# EAGLE design Adafruit INA3221 Breakout (EAGLE 9.6.2)
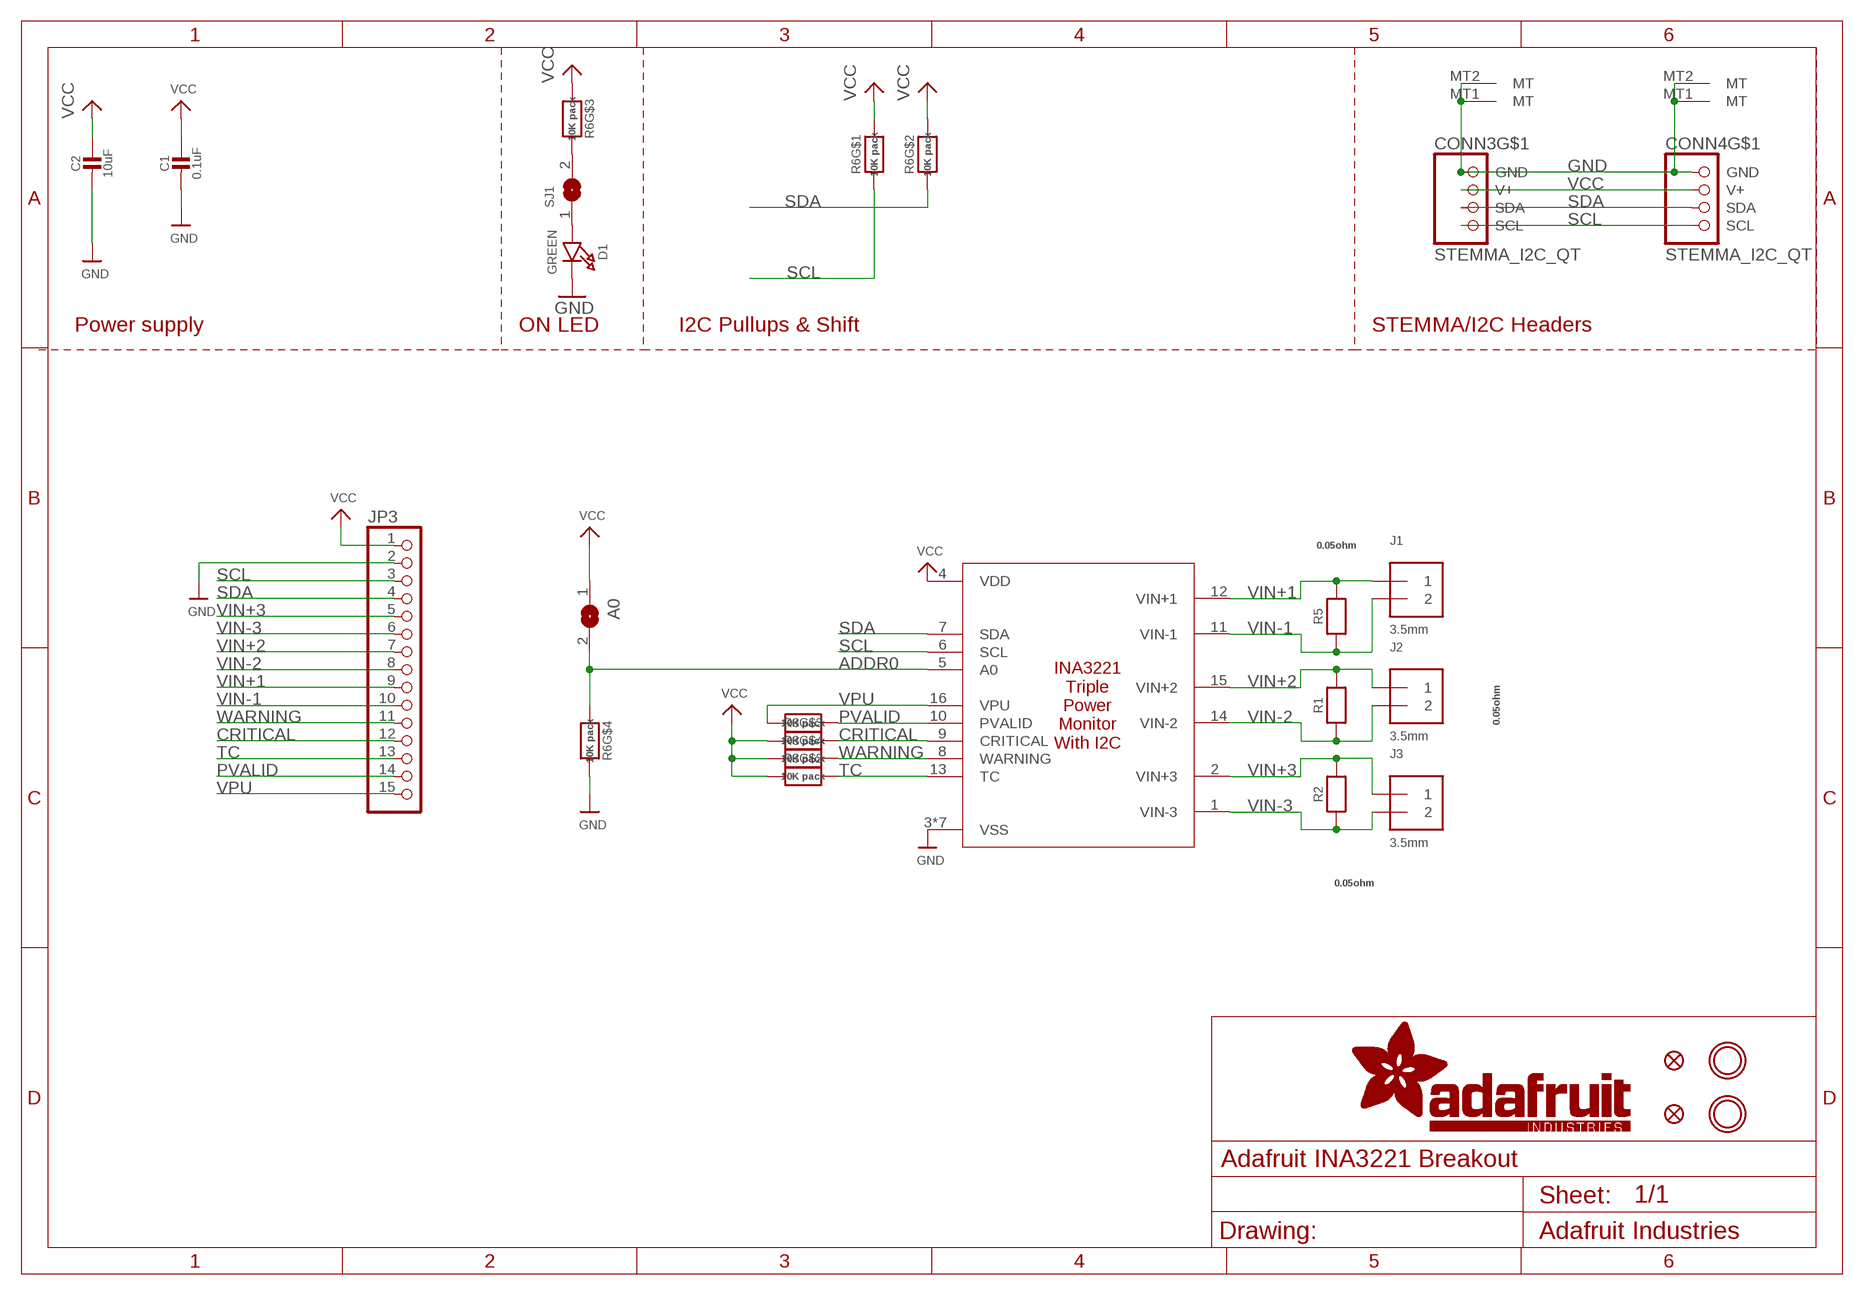
[diagram p0: schematic, sheet 1]

## Parts
A0  SOLDERJUMPERREFLOW_NOPASTE  [SOLDERJUMPER_REFLOW_NOPASTE]
C1  0.1uF  CAP_CERAMIC0603_NO  [0603-NO]
C2  10uF  CAP_CERAMIC0805-NOOUTLINE  [0805-NO]
CONN3  STEMMA_I2C_QT  [JST_SH4]
CONN4  STEMMA_I2C_QT  [JST_SH4]
D1  GREEN  LED0603_NOOUTLINE  [CHIPLED_0603_NOOUTLINE]
FID3  FIDUCIAL_1MM  [FIDUCIAL_1MM]
FID4  FIDUCIAL_1MM  [FIDUCIAL_1MM]
IC1  INA3221  [PVQFN-16]
J1  3.5mm  TERMBLOCK_1X2_3.5MM  [TERMBLOCK_1X2-3.5MM]
J2  3.5mm  TERMBLOCK_1X2_3.5MM  [TERMBLOCK_1X2-3.5MM]
J3  3.5mm  TERMBLOCK_1X2_3.5MM  [TERMBLOCK_1X2-3.5MM]
JP3  HEADER-1X15  [1X15_ROUND_70]
R1  0.05ohm  RESISTOR_1206  [_1206]
R2  0.05ohm  RESISTOR_1206  [_1206]
R3  10K pack  RESISTOR_4PACK  [RESPACK_4X0603]
R5  0.05ohm  RESISTOR_1206  [_1206]
R6  10K pack  RESISTOR_4PACK  [RESPACK_4X0603]
SJ1  SOLDERJUMPERCLOSED  [SOLDERJUMPER_CLOSEDWIRE]
U$20  MOUNTINGHOLE2.5  [MOUNTINGHOLE_2.5_PLATED]
U$21  MOUNTINGHOLE2.5  [MOUNTINGHOLE_2.5_PLATED]

## Nets
ADDR0: A0.2 IC1.5(A0) R6.4
CRITICAL: IC1.9(CRITICAL) JP3.12 R3.6
GND: C1.2 C2.2 CONN3.1(GND) CONN3.MT1(MT) CONN3.MT2(MT) CONN4.1(GND) CONN4.MT1(MT) CONN4.MT2(MT) D1.C IC1.3(VSS) IC1.P$18(VSS) IC1.P$19(VSS) IC1.P$20(VSS) IC1.P$21(VSS) IC1.P$22(VSS) IC1.THERMAL(VSS) JP3.2 R6.5
N$1: R6.6 SJ1.2
N$2: D1.A SJ1.1
PVALID: IC1.10(PVALID) JP3.14 R3.8
SCL: CONN3.4(SCL) CONN4.4(SCL) IC1.6(SCL) JP3.3 R6.1
SDA: CONN3.3(SDA) CONN4.3(SDA) IC1.7(SDA) JP3.4 R6.2
TC: IC1.13(TC) JP3.13 R3.7
VCC: A0.1 C1.1 C2.1 CONN3.2(V+) CONN4.2(V+) IC1.4(VDD) JP3.1 R3.2 R3.3 R3.4 R6.3 R6.7 R6.8
VIN+1: IC1.12(VIN+1) J1.1 JP3.9 R5.2
VIN+2: IC1.15(VIN+2) J2.1 JP3.7 R1.2
VIN+3: IC1.2(VIN+3) J3.1 JP3.5 R2.2
VIN-1: IC1.11(VIN-1) J1.2 JP3.10 R5.1
VIN-2: IC1.14(VIN-2) J2.2 JP3.8 R1.1
VIN-3: IC1.1(VIN-3) J3.2 JP3.6 R2.1
VPU: IC1.16(VPU) JP3.15 R3.1
WARNING: IC1.8(WARNING) JP3.11 R3.5

## Notes on the sheet
- Power supply | ON LED | I2C Pullups & Shift | STEMMA/I2C Headers

## Library data of the parts
A0 SJ1 = microbuilder:SOLDERJUMPER: SMD Solder JUMPER Solder the two pads together to create a connection, or remove the solder to break it. REFLOW - Use this footprint for solder paste and reflow ovens. WAVE - Use this footprint for hand-soldering (larger pads). CLOSED - Has a trace between the two pads to ensure it is closed by default. The trace needs to be cut to disable the jumper, and can be closed again by creating a solder bridge between the two pads.
C1 C2 = microbuilder:CAP_CERAMIC: Ceramic Capacitors For new designs, use the packages preceded by an '_' character since they are more reliable: The following footprints should be used on most boards: _0402 - Standard footprint for regular board layouts _0603 - Standard footprint for regular board layouts _0805 - Standard footprint for regular board layouts _1206 - Standard footprint for regular board layouts For extremely tight-pitch boards where space is at a premium, the following 'micro-pitch' footprints can be used (smaller pads, no silkscreen outline, etc.): _0402MP - Micro-pitch footprint for very dense/compact boards _0603MP - Micro-pitch footprint for very dense/compact boards _0805MP - Micro-pitch footprint for very dense/compact boards _1206MP - Micro-pitch footprint for very dense/compact boards
CONN3 CONN4 = adafruit_electromech:STEMMA_I2C; LCSC: C2845363
D1 = microbuilder:LED: LED 0603 - 0603 Surface Mount Package 2mA: Green LED - Low Power (3.9mcd, 2ma, 1.7Vf) - Digikey: 475-2709-2-ND Orange LED - Low Power (9.8mcd, 2ma, 1.8Vf) - Digikey: 475-1194-2-ND Red LED - Low Power (5mcd, 2ma, 1.8Vf) - Digikey: 475-1195-2-ND Yellow LED - Low Power (7mcd, 2ma, 1.8Vf) - Digikey: 475-1196-2-ND 5mA: Blue LED - Low Power (17mcd, 5ma, 2.9Vf) - Digikey: LNJ937W8CRACT-ND 0805 - 0805 Surface Mount Package 2mA: Red LED (8.8mcd, 2mA, 1.8Vf, Clear) - Low Power [Digikey: 475-2510-1-ND] Green LED (5mcd, 2mA, 1.8Vf, Clear) - Low Power [Digikey: 475-2730-1-ND] Yellow LED (11.3mcd, 2mA, 1.8Vf, Clear) - Low Power [Digikey: 475-2555-1-ND] 20mA: Red LED (104mcd, 20mA, Diffused) - LS R976 [Digikey: 475-1278-6-ND] Red LED (12mcd, 20mA, 2.0Vf, Clear) - APT2012EC [Digikey: 754-1128-1-ND] Green LED (15mcd, 20mA, 2.2Vf, Clear) - APT2012GC [Digikey: 754-1131-1-ND] Orange LED (160mcd, 20mA, 2.1Vf, Clear) - APT2012SECK [Digikey: 754-1130-1-ND] 1206 - 1206 Surface Mount Package Green LED (26mcd, 20mA, Diffused) - LG N971 [Digikey: 475-1407-6-ND] Red LED (15mcd, 20mA, Diffused) - LH N974 [Digikey: 475-1416-6-ND] Cree - Cree High-Power Surface Mount LEDs XPEBWT-L1-0000-00D50 - White 111lm 350mA 2.9Vf 6200K 110° XTEAWT-00-0000-00000LEE3 - White 114lm 350mA 2.85Vf 5000K 115° Everlight - Everlight 45-21 Series Surface Mount LEDs 45-21/QK2C-B2832AC2CB2/2T - Warm White 2000mcd 20mA 3.25Vf 3050K 120° 45-21/LK2C-B38452C4CB2/2T - Nuetral White 2000mcd 20mA 3.25Vf 4150K 120° 45-21/LK2C-B50634C6CB2/2T - Cold White 2200mcd 20mA 3.25Vf 5650K 120° PLCC2 Reverse Mount LS T77K-J1L2-1-0-2-R18-Z - Red 11.25mcd 2mA 1.8Vf 630nm 120° LO T77K-L1M2-24-Z - Orange 19.6mcd 2mA 1.8Vf 606nm 120° LY T77K-K2M1-26-Z - Yellow 15.7mcd 2mA 1.8Vf 587nm 120°; ROT: 270
FID3 FID4 = microbuilder:FIDUCIAL: Fiducial Alignment Points Various fiducial points for machine vision alignment.; BOM: EXCLUDE
IC1 = adafruit_power:INA3221
J1-J3 = adafruit_electromech:TERMBLOCK_1X2: 3.5mm Terminal block http://www.ladyada.net/library/pcb/eaglelibrary.html; ROT: 180
JP3 = microbuilder:HEADER-1X15: 1x15 Header
R1 R2 R5 = microbuilder:RESISTOR: Resistors For new designs, use the packages preceded by an '_' character since they are more reliable: The following footprints should be used on most boards: _0402 - Standard footprint for regular board layouts _0603 - Standard footprint for regular board layouts _0805 - Standard footprint for regular board layouts _1206 - Standard footprint for regular board layouts For extremely tight-pitch boards where space is at a premium, the following 'micro-pitch' footprints can be used (smaller pads, no silkscreen outline, etc.): _0402MP - Micro-pitch footprint for very dense/compact boards _0603MP - Micro-pitch footprint for very dense/compact boards _0805MP - Micro-pitch footprint for very dense/compact boards _1206MP - Micro-pitch footprint for very dense/compact boards
R3 R6 = microbuilder:RESISTOR_4PACK: Resistor Packs (4 resistors) 4 x 0603 10K 1/16W - Digikey: YC164J-10KCT-ND
U$20 U$21 = adafruit_electromech:MOUNTINGHOLE: Mounting Hole For #2 screws (0.086"/2.18mm width, 0.094"/2.4mm hole) use 2.5mm; BOM: EXCLUDE

## Net classes
1 highpower: width 0.305 mm, drill 0.483 mm
2 lowpower: width 0.254 mm, drill 0.483 mm

## Board
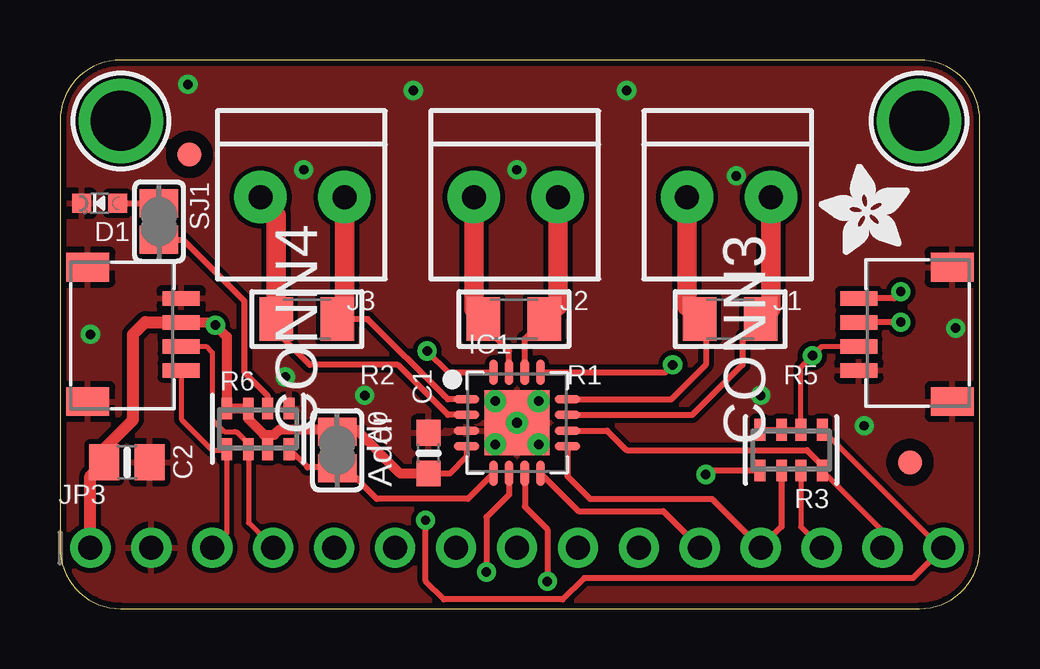
[diagram p1: board, top side]
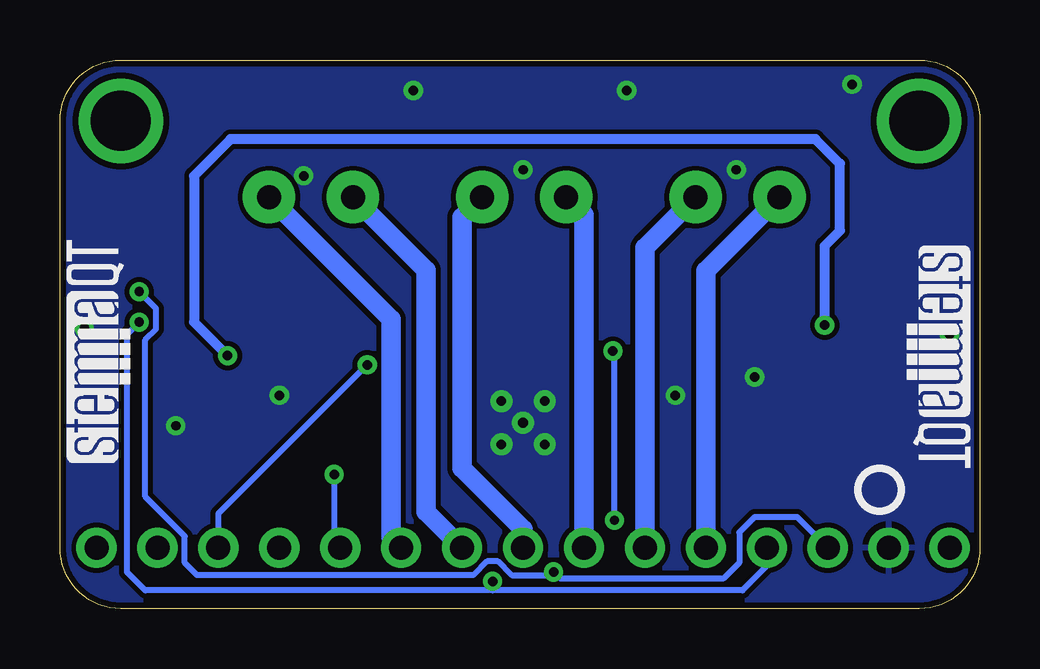
[diagram p2: board, bottom side, seen from below]

Size 38.35 x 22.86 mm. Coordinates in mm from the lower left corner, seen from the top.
Outline: 0,20.32 0,2.54 arc90 2.54,0 35.81,0 arc90 38.35,2.54 38.35,20.32 arc90 35.81,22.86 2.54,22.86 arc90 0,20.32
Copper layers (1*16): Top 0.035mm / dielectric 1.5mm / Bottom 0.035mm
Design rules "adafruit 7-7": minimum track width 6mil, minimum drill 15.5mil, track to track 8mil, track to pad 7mil, pad to pad 7mil, via to via 7mil, smd to smd 7mil, copper to edge 10mil, drill to drill 8mil, minimum pad ring 10mil, minimum via ring 8mil, stop-mask expansion 2mil, vias tented up to drill 20mil, thermal gap 10mil
bRestrict: area 10.2,2.5 to 10.3,3

### Footprints (pad centres in the part's own frame; a part is rotated, then mirrored left to right if it is on the bottom)
SOLDERJUMPER_REFLOW_NOPASTE = smd 1.168 x 1.6: 1 -0.762,0; 2 0.762,0
0603-NO = smd 1.075 x 1: 1 -0.85,0; 2 0.85,0
0805-NO = smd 1.24 x 1.5: 1 -0.95,0; 2 0.95,0
JST_SH4 = smd 0.6 x 1.55: 1 -1.5,2.006; 2 -0.5,2.006; 3 0.5,2.006; 4 1.5,2.006 | smd 1.2 x 1.8: MT1 -2.8,-1.894; MT2 2.8,-1.894
CHIPLED_0603_NOOUTLINE = smd 0.8 x 0.8: A 0,-0.75; C 0,0.75
FIDUCIAL_1MM = smd 1 x 1: 1 0,0
PVQFN-16 = smd 1.05 x 0.35: 1 -2.1,0.975; 2 -2.1,0.325; 3 -2.1,-0.325; 4 -2.1,-0.975; 9 2.1,-0.975; 10 2.1,-0.325; 11 2.1,0.325; 12 2.1,0.975 | smd 0.35 x 1.05: 5 -0.975,-2.1; 6 -0.325,-2.1; 7 0.325,-2.1; 8 0.975,-2.1; 13 0.975,2.1; 14 0.325,2.1; 15 -0.325,2.1; 16 -0.975,2.1 | drill 0.4: P$18 0,0; P$19 -0.9,0.9; P$20 0.9,0.9; P$21 0.9,-0.9; P$22 -0.9,-0.9 | smd 2.7 x 2.7: THERMAL 0,0
TERMBLOCK_1X2-3.5MM = drill 1 pad 2.184: 1 1.8,0; 2 -1.7,0
1X15_ROUND_70 = drill 1 pad 1.676: 1 -17.78,0; 2 -15.24,0; 3 -12.7,0; 4 -10.16,0; 5 -7.62,0; 6 -5.08,0; 7 -2.54,0; 8 0,0; 9 2.54,0; 10 5.08,0; 11 7.62,0; 12 10.16,0; 13 12.7,0; 14 15.24,0; 15 17.78,0
_1206 = smd 1.4 x 1.8: 1 -1.27,0; 2 1.27,0
RESPACK_4X0603 = smd 0.45 x 0.9: 1 -1.3,-0.85; 2 -0.4,-0.85; 3 0.4,-0.85; 4 1.3,-0.85; 5 1.3,0.85; 6 0.4,0.85; 7 -0.4,0.85; 8 -1.3,0.85
SOLDERJUMPER_CLOSEDWIRE = smd 1.168 x 1.6: 1 -0.762,0; 2 0.762,0 | smd 0.635 x 0.203: WIRE 0,0
MOUNTINGHOLE_2.5_PLATED = drill 2.5 pad 3.2: P$1 0,0

### Placement (x,y rotation side)
A0  11.56,6.6 270 top
C1  15.37,6.48 90 top
C2  2.79,6.1 0 top
CONN3  35.31,11.43 90 top
CONN4  3.05,11.43 270 top
D1  1.65,16.89 90 top
FID3  5.4,18.92 0 top
FID4  35.43,6.1 0 top
IC1  19.05,7.75 0 top
J1  27.94,17.14 180 top
J2  19.05,17.14 180 top
J3  10.16,17.14 180 top
JP3  19.05,2.54 0 top
PLABEL0  [PLABEL0]  10.03,21.78 0 top
PLABEL1  [PLABEL1]  11.51,4.18 0 top
PLABEL2  [PLABEL2]  6.22,9.14 0 top
PLABEL3  [PLABEL3]  21.72,4.95 0 top
PLABEL4  [PLABEL4]  1.65,4.19 0 top
PLABEL5  [PLABEL5]  4.06,1.02 0 top
PLABEL6  [PLABEL6]  6.35,4.19 0 top
PLABEL7  [PLABEL7]  9.02,1.02 0 top
PLABEL8  [PLABEL8]  12.83,0.89 0 top
PLABEL9  [PLABEL9]  29.21,1.02 0 top
PLABEL10  [PLABEL10]  0.89,15.49 0 top
PLABEL11  [PLABEL11]  5.84,14.99 90 top
PLABEL12  [PLABEL12]  17.91,0.89 0 top
PLABEL13  [PLABEL13]  22.99,0.89 0 top
PLABEL14  [PLABEL14]  26.67,4.06 0 top
PLABEL15  [PLABEL15]  31.75,4.06 0 top
PLABEL16  [PLABEL16]  34.29,1.02 0 top
PLABEL17  [PLABEL17]  36.83,4.06 0 top
PLABEL18  [PLABEL18]  16.59,4.18 0 top
PLABEL19  [PLABEL19]  21.67,4.18 0 top
PLABEL20  [PLABEL20]  14.05,4.18 0 top
PLABEL21  [PLABEL21]  19.13,4.18 0 top
PLABEL22  [PLABEL22]  23.96,4.18 0 top
PLABEL23  [PLABEL23]  19.18,21.78 0 top
PLABEL24  [PLABEL24]  27.81,21.78 0 top
PLABEL25  [PLABEL25]  19.81,20.32 0 bottom
PLABEL26  [PLABEL26]  32.89,6.99 0 bottom
PLABEL27  [PLABEL27]  18.29,0.89 0 bottom
PLABEL28  [PLABEL28]  19.05,13.34 0 bottom
R1  18.92,12.06 180 top
R2  10.29,12.06 180 top
R3  30.48,6.6 180 top
R5  27.94,12.06 180 top
R6  8.26,7.49 0 top
SJ1  4.13,16.13 270 top
U$7  [ADAFRUIT_3.5MM]  35.43,14.73 90 top
U$20  2.54,20.32 0 top
U$21  35.81,20.32 0 top
U$30  [PCBFEAT-REV-040]  4.19,4.95 0 bottom
U$31  [STEMMAQT]  35.43,6.1 90 bottom
U$32  [STEMMAQT]  3.05,15.11 270 bottom

### Tracks (layer width: path | path; a pad name or v marks a point on that pad's centre or on a via)
ADDR0
  Top 0.254: IC1.5 17,4.57 13.21,4.57 11.9,5.88 11.68,5.88 10.32,5.88 R6.4
  Top 0.406: A0.2 11.6,5.88 11.68,5.88
CRITICAL
  Top 0.254: IC1.9 21.15,5.52 22.1,4.57 27.18,4.57 JP3.12 30.08,3.41 R3.6
GND  (via drill 0.39)
  other vias: 1.27,11.43 10.16,18.29 19.05,18.29 28.19,18.03 23.62,21.59 14.73,21.59 5.33,21.84 37.34,11.68 33.53,7.62 29.21,8.89 12.7,8.89 9.4,9.65
  pour Top: 0,22.86 38.35,22.86 38.35,0 0,0
  pour Bottom: 0,22.86 38.35,22.86 38.35,0 0,0
N$1
  Top 0.254: SJ1.2 5.14,15.37 7.68,12.83 7.68,9.84 8.65,8.87 R6.6
N$2
  Top 0.254: D1.A SJ1.1
PVALID
  Top 0.203: R3.8 34.29,3.24 JP3.14
  Top 0.254: IC1.10 22.8,7.42 23.62,6.6 31.14,6.6 31.78,5.96 R3.8
SCL  (via drill 0.39)
  Top 0.203: CONN4.4 5.05,7.9 6.35,6.6 6.92,6.6 R6.1 6.96,3.15 JP3.3
  Top 0.254: IC1.6 18.73,4.75 17.78,3.81 v17.78,1.52 | v35.05,13.21 34.77,12.93 CONN3.4
  Bottom 0.254: v35.05,13.21 34.35,12.5 34.35,11.65 34.8,11.2 34.8,4.66 33.15,3.01 33.15,1.91 32.64,1.4 21.12,1.4 20.55,1.97 20.09,1.97 19.52,1.4 17.91,1.4 v17.78,1.52 17.53,1.27 10.67,1.27 10.03,1.91 10.03,3.17 9.4,3.81 7.62,3.81 JP3.3
SDA  (via drill 0.39)
  Top 0.203: CONN4.3 6.09,10.93 6.35,10.67 6.35,7.87 6.85,7.37 7.3,7.37 7.37,7.37 7.86,6.88 R6.2 7.86,3.58 JP3.4
  Top 0.254: IC1.7 19.38,4.25 20.32,3.3 v20.32,1.14 | v35.05,11.94 v35.04,11.93 CONN3.3
  Bottom 0.254: v35.05,11.94 35.56,11.43 35.56,1.52 34.8,0.76 20.32,0.76 | JP3.4 8.89,1.78 9.91,0.76 20.32,0.76 | v20.32,1.14 20.32,0.76
TC  (via drill 0.39)
  Top 0.203: R3.7 30.88,3.41 JP3.13
  Top 0.254: v25.54,10.16 25.23,9.85 IC1.13
  Bottom 0.254: v25.54,10.16 31.75,3.95 JP3.13
VCC  (via drill 0.39)
  Top 0.203: R3.4 R3.3 R3.2 30.88,10.05 v31.37,10.54 31.76,10.93 CONN3.2 | R6.3 8.65,7.09 8.51,7.24
  Top 0.254: IC1.4 16.95,6.32 16.26,5.63 C1.1
  Top 0.406: CONN4.2 6.36,11.93 v6.48,11.81 6.96,11.33 R6.8 R6.7 7.86,7.89 8.51,7.24 8.94,7.24 9.17,7.47 11.43,7.47 | 11.43,7.47 12.34,7.47 14.19,5.63 C1.1 | A0.1 11.54,7.37 11.43,7.47
  Top 0.508: JP3.1 1.27,5.52 C2.1 1.84,6.67 3.05,7.87 3.05,11.43 3.56,11.94 CONN4.2
  Bottom 0.406: v6.48,11.81 6.48,15.11 5.84,15.75 5.84,18.54 6.86,19.56 31.24,19.56 32.77,18.03 32.77,11.94 v31.37,10.54
VIN+1
  Top 0.254: IC1.12 25.49,8.72 26.92,10.16 26.92,11.81 R5.2
  Top 0.813: J1.1 26.14,12.6 R5.2
  Bottom 0.813: JP3.9 23.09,4.04 23.09,14.1 J1.1
VIN+2
  Top 0.254: IC1.15 18.73,10.74 17.65,11.81 R1.2
  Top 0.813: J2.1 17.25,12.47 R1.2
  Bottom 0.813: J2.1 16.51,16.41 JP3.7
VIN+3
  Top 0.254: IC1.2 16.17,8.07 14.09,10.16 10.41,10.16 9.02,11.56 R2.2
  Top 0.813: J3.1 8.36,17.04 9.02,16.38 R2.2
  Bottom 0.813: JP3.5 11.43,7.37 11.43,14.07 J3.1
VIN-1
  Top 0.254: IC1.11 26.36,8.07 28.45,10.16 28.45,11.3 R5.1
  Top 0.813: J1.2 29.64,12.49 R5.1
  Bottom 0.813: JP3.10 24.56,2.97 24.56,12.06 J1.2
VIN-2
  Top 0.254: IC1.14 19.38,11.25 R1.1
  Top 0.813: J2.2 20.75,12.62 R1.1
  Bottom 0.813: JP3.8 19.05,3.3 21.59,5.84 21.59,16.3 J2.2
VIN-3
  Top 0.254: IC1.1 16.17,8.72 16,8.89 12.83,12.06 R2.1
  Top 0.813: J3.2 11.86,12.37 R2.1
  Bottom 0.813: JP3.6 13.97,15.04 J3.2
VPU  (via drill 0.39)
  Top 0.203: R3.1 36.69,2.54 JP3.15
  Top 0.254: JP3.15 35.56,1.27 21.84,1.27 20.95,0.38 16,0.38 15.24,1.14 v15.24,3.68 | IC1.16 16.19,9.85 v15.3,10.73
  Bottom 0.254: v15.24,3.68 15.24,10.67 v15.3,10.73
WARNING  (via drill 0.39)
  Top 0.254: IC1.8 21.61,4.06 25.15,4.06 JP3.11 | R3.5 27.09,5.75 v26.92,5.59
  Bottom 0.254: v26.92,5.59 26.92,2.79 JP3.11

### Text on the board
tPlace: Addr
Pinguin_tBackup: + 3 - | + 2 - | + 1 - | on | LED | INA3221 | 3x 0-26VDC / Current / Sensor | VCC | SCL | + | - | + | - | + | - | WRN | TC | VPU | GND | SDA | VIN3 | VIN2 | VIN1 | CRI | VALID
Pinguin_bBackup: INA3221 | Triple High or Low Side / DC Current Monitor | Bus Voltages: 0-26V / Max Current: ±3.2A per chan / Default I2C Addr 0x40 | VLogic/Vcc: 3-5VDC